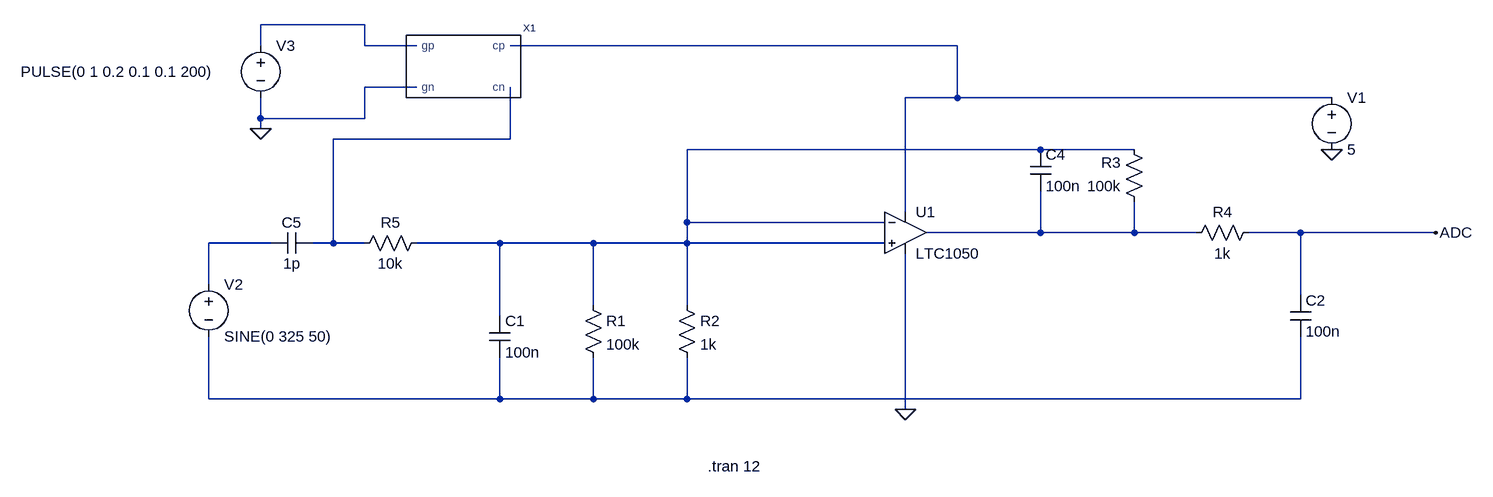
[diagram p0: schematic Ampli transimpédance.asc]
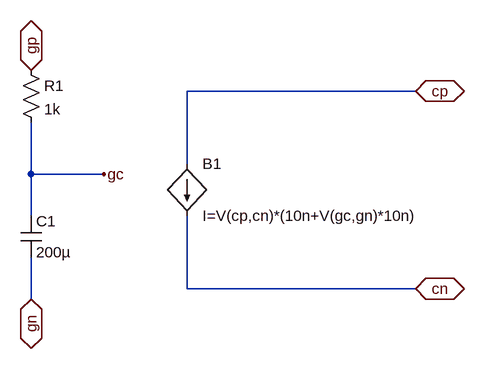
[diagram p1: sub-circuit jauge_graphite.asc]
Ampli transimpédance.asc, the LTspice schematic file:
Version 4
SHEET 1 1408 680
WIRE -304 -416 -464 -416
WIRE -464 -384 -464 -416
WIRE -304 -384 -304 -416
WIRE -224 -384 -304 -384
WIRE 608 -384 -80 -384
WIRE -224 -320 -304 -320
WIRE 608 -304 608 -384
WIRE 608 -304 528 -304
WIRE 1184 -304 608 -304
WIRE -464 -272 -464 -304
WIRE -304 -272 -304 -320
WIRE -304 -272 -464 -272
WIRE -464 -256 -464 -272
WIRE -80 -240 -80 -320
WIRE -80 -240 -352 -240
WIRE 736 -224 192 -224
WIRE 880 -224 736 -224
WIRE 528 -128 528 -304
WIRE 192 -112 192 -224
WIRE 496 -112 192 -112
WIRE 736 -96 736 -160
WIRE 736 -96 560 -96
WIRE 880 -96 880 -144
WIRE 880 -96 736 -96
WIRE 976 -96 880 -96
WIRE 1136 -96 1056 -96
WIRE 1344 -96 1136 -96
WIRE -448 -80 -544 -80
WIRE -352 -80 -352 -240
WIRE -352 -80 -384 -80
WIRE -304 -80 -352 -80
WIRE -96 -80 -224 -80
WIRE 48 -80 -96 -80
WIRE 192 -80 192 -112
WIRE 192 -80 48 -80
WIRE 496 -80 192 -80
WIRE -544 -16 -544 -80
WIRE 1136 0 1136 -96
WIRE 48 16 48 -80
WIRE 192 16 192 -80
WIRE -96 32 -96 -80
WIRE -544 160 -544 64
WIRE -96 160 -96 96
WIRE -96 160 -544 160
WIRE 48 160 48 96
WIRE 48 160 -96 160
WIRE 192 160 192 96
WIRE 192 160 48 160
WIRE 1136 160 1136 64
WIRE 1136 160 192 160
WIRE 528 176 528 -64
FLAG 1344 -96 ADC
FLAG 528 176 0
FLAG 1184 -224 0
FLAG -464 -256 0
SYMBOL res 32 0 R0
SYMATTR InstName R1
SYMATTR Value 100k
SYMBOL res 176 0 R0
SYMATTR InstName R2
SYMATTR Value 1k
SYMBOL res 896 -128 R180
WINDOW 0 36 76 Left 2
WINDOW 3 36 40 Left 2
SYMATTR InstName R3
SYMATTR Value 100k
SYMBOL res 960 -80 R270
WINDOW 0 32 56 VTop 2
WINDOW 3 0 56 VBottom 2
SYMATTR InstName R4
SYMATTR Value 1k
SYMBOL res -320 -64 R270
WINDOW 0 32 56 VTop 2
WINDOW 3 0 56 VBottom 2
SYMATTR InstName R5
SYMATTR Value 10k
SYMBOL cap -112 32 R0
SYMATTR InstName C1
SYMATTR Value 100n
SYMBOL cap 1120 0 R0
SYMATTR InstName C2
SYMATTR Value 100n
SYMBOL cap 720 -224 R0
SYMATTR InstName C4
SYMATTR Value 100n
SYMBOL OpAmps\\LTC1050 528 -160 R0
SYMATTR InstName U1
SYMBOL voltage 1184 -320 R0
WINDOW 123 0 0 Left 0
WINDOW 39 0 0 Left 0
SYMATTR InstName V1
SYMATTR Value 5
SYMBOL Jauge_Graphite -144 -352 R0
SYMATTR InstName X1
SYMBOL cap -384 -96 R90
WINDOW 0 0 32 VBottom 2
WINDOW 3 32 32 VTop 2
SYMATTR InstName C5
SYMATTR Value 1p
SYMBOL voltage -544 -32 R0
SYMATTR InstName V2
SYMATTR Value SINE(0 325 50)
SYMBOL voltage -464 -400 R0
WINDOW 3 -369 56 Left 2
WINDOW 123 0 0 Left 0
WINDOW 39 0 0 Left 0
SYMATTR InstName V3
SYMATTR Value PULSE(0 1 0.2 0.1 0.1 200)
TEXT 224 264 Left 2 !.tran 12

jauge_graphite.asc, the sub-circuit schematic file:
Version 4
SHEET 1 880 680
WIRE 384 16 32 16
WIRE 32 128 32 16
WIRE -208 144 -208 64
WIRE -96 144 -208 144
WIRE -208 208 -208 144
WIRE 32 320 32 208
WIRE 384 320 32 320
WIRE -208 336 -208 272
FLAG 384 16 cp
IOPIN 384 16 BiDir
FLAG 384 320 cn
IOPIN 384 320 BiDir
FLAG -208 -16 gp
IOPIN -208 -16 BiDir
FLAG -208 336 gn
IOPIN -208 336 BiDir
FLAG -96 144 gc
SYMBOL bi 32 128 R0
SYMATTR InstName B1
SYMATTR Value I=V(cp,cn)*(10n+V(gc,gn)*10n)
SYMBOL res -224 -32 R0
SYMATTR InstName R1
SYMATTR Value 1k
SYMBOL cap -224 208 R0
SYMATTR InstName C1
SYMATTR Value 200µ

The netlist it stands for:
* Ampli transimpédance.asc
R1 N004 N007 100k
R2 N004 N007 1k
R3 N005 N004 100k
R4 N005 ADC 1k
R5 N003 N004 10k
C1 N004 N007 100n
C2 ADC N007 100n
C4 N004 N005 100n
XU1 N004 N004 N002 0 N005 LTC1050  ; pins In+ In- V+ V- OUT
V1 N002 0 5
XX1 N002 N003 N001 0 jauge_graphite
C5 N003 N006 1p
V2 N006 N007 SINE(0 325 50)
V3 N001 0 PULSE(0 1 0.2 0.1 0.1 200)

* block symbol definitions
.subckt jauge_graphite cp cn gp gn
B1 cp cn I=V(cp,cn)*(10n+V(gc,gn)*10n)
R1 gp gc 1k
C1 gc gn 200µ
.ends jauge_graphite

.tran 12
.lib LTC.lib
.backanno
.end